# EAGLE design FEP_of_Exodia ver2 (EAGLE 9.6.2)
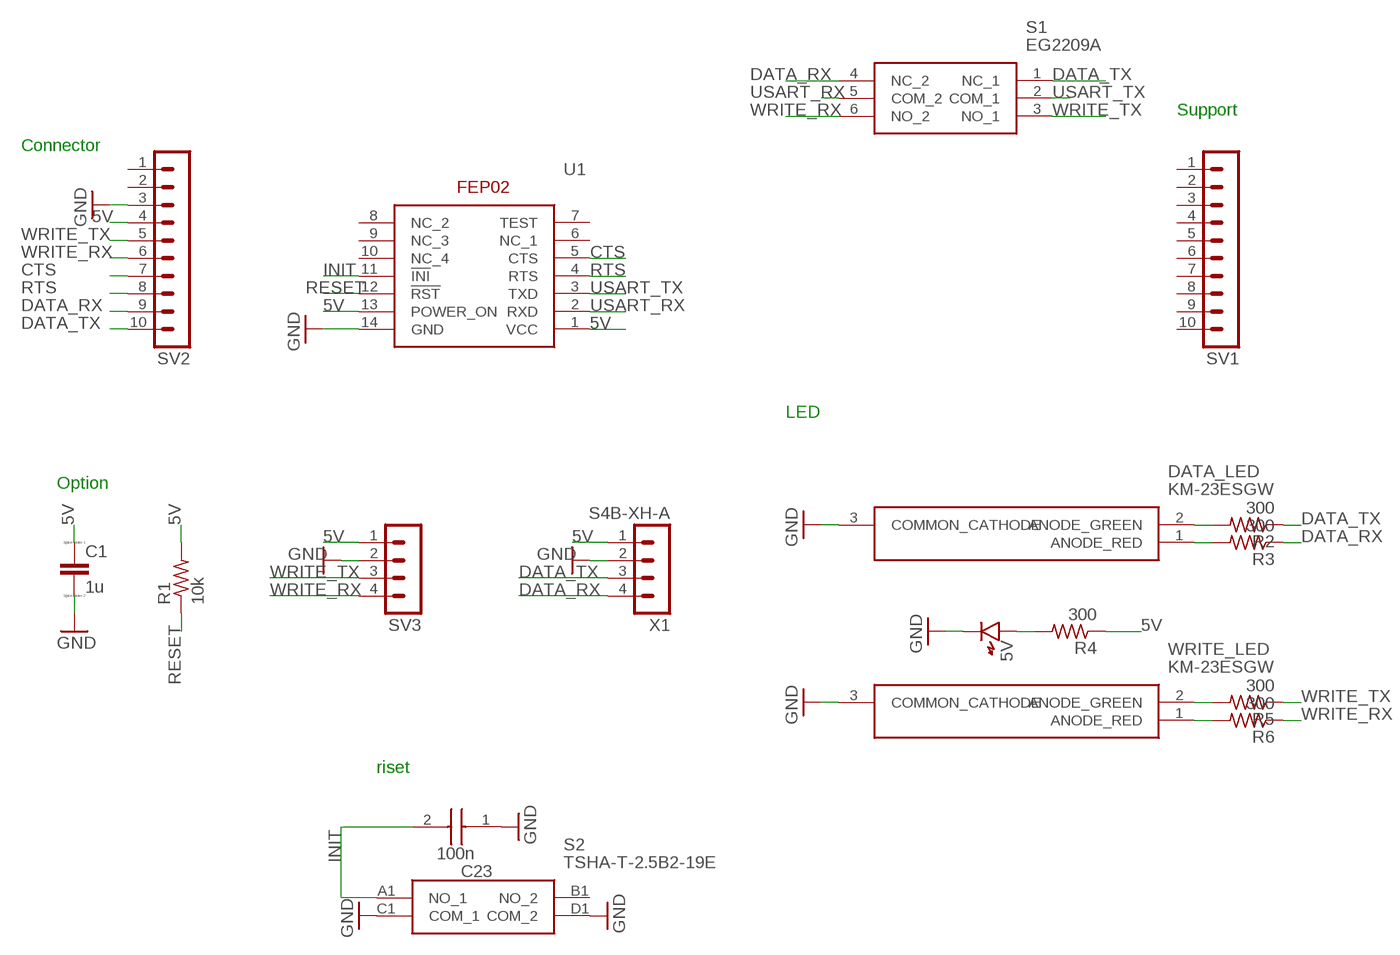
[diagram p0: schematic, sheet 1]

## Parts
5V  LED1608  [LED1608]
C1  1u  CC0603  [C0603]
C23  100n  AMK107BBJ476MA-RE  [CAPC1709X100N]
DATA_LED  KM-23ESGW  [SOT-23]
R1  10k  R-US_R0603  [R0603]
R2  300  R-US_R0603  [R0603]
R3  300  R-US_R0603  [R0603]
R4  300  R-US_R0603  [R0603]
R5  300  R-US_R0603  [R0603]
R6  300  R-US_R0603  [R0603]
S1  EG2209A  [EG2209A]
S2  TSHA-T-2.5B2-19E  [TSHAT25B219E]
SV1  MA10-1  [MA10-1]
SV2  MA10-1  [MA10-1]
SV3  MA04-1  [MA04-1]
U1  FEP02  [FEP02]
WRITE_LED  KM-23ESGW  [SOT-23]
X1  S4B-XH-A  [S4B-XH-A]

## Nets
5V: C1.1 R1.2 R4.1 SV2.4 SV3.1 U1.1(VCC) U1.13(POWER_ON) X1.1
CTS: SV2.7 U1.5(CTS)
DATA_RX: R3.1 S1.4(NC_2) SV2.9 X1.4
DATA_TX: R2.1 S1.1(NC_1) SV2.10 X1.3
GND: 5V.K C1.2 C23.1 DATA_LED.3(COMMON_CATHODE) S2.C1(COM_1) S2.D1(COM_2) SV2.3 SV3.2 U1.14(GND) WRITE_LED.3(COMMON_CATHODE) X1.2
INIT: C23.2 S2.A1(NO_1) U1.11(!INI)
N$1: DATA_LED.1(ANODE_RED) R3.2
N$2: DATA_LED.2(ANODE_GREEN) R2.2
N$3: 5V.A R4.2
N$4: R6.2 WRITE_LED.1(ANODE_RED)
N$5: R5.2 WRITE_LED.2(ANODE_GREEN)
RESET: R1.1 U1.12(!RST)
RTS: SV2.8 U1.4(RTS)
USART_RX: S1.5(COM_2) U1.2(RXD)
USART_TX: S1.2(COM_1) U1.3(TXD)
WRITE_RX: R6.1 S1.6(NO_2) SV2.6 SV3.4
WRITE_TX: R5.1 S1.3(NO_1) SV2.5 SV3.3
Unconnected: S2.B1(NO_2) SV1.1 SV1.2 SV1.3 SV1.4 SV1.5 SV1.6 SV1.7 SV1.8 SV1.9 SV1.10 SV2.1 SV2.2 U1.6(NC_1) U1.7(TEST) U1.8(NC_2) U1.9(NC_3) U1.10(NC_4)

## Notes on the sheet
- Support
- Connector
- LED
- Option
- riset

## Library data of the parts
5V = generic:LED: Generic LEDs
C1 = eagle-ltspice:C: CAPACITOR, European symbol; SPICEMODEL: NONE; SPICEPREFIX: C
C23 = SamacSys_Parts:AMK107BBJ476MA-RE: 0603 (1608M) 47uF MLCC 4V dc +/-20% SMD Source: Datasheet <https://ds.yuden.co.jp/TYCOMPAS/ut/detail?pn=AMK107BBJ476MA-RE&u=M>; DESCRIPTION: 0603 (1608M) 47uF MLCC 4V dc +/-20% SMD; HEIGHT: 1mm; MANUFACTURER_NAME: TAIYO YUDEN; MANUFACTURER_PART_NUMBER: AMK107BBJ476MA-RE; MOUSER_PART_NUMBER: 963-AMK107BBJ476MARE; MOUSER_PRICE-STOCK: https://www.mouser.com/Search/Refine.aspx?Keyword=963-AMK107BBJ476MARE; RS_PART_NUMBER: 1843762P; RS_PRICE-STOCK: http://uk.rs-online.com/web/p/products/1843762P
DATA_LED WRITE_LED = SamacSys_Parts:KM-23ESGW: KINGBRIGHT - KM-23ESGW - LED, SMD, RED/GRN Source: Datasheet <http://www.farnell.com/datasheets/2047454.pdf>; DESCRIPTION: KINGBRIGHT - KM-23ESGW - LED, SMD, RED/GRN; HEIGHT: mm; MANUFACTURER_NAME: Kingbright; MANUFACTURER_PART_NUMBER: KM-23ESGW; MOUSER_PART_NUMBER: N/A; MOUSER_PRICE-STOCK: https://www.mouser.com/Search/Refine.aspx?Keyword=N%2FA
R1-R6 = audio amplifier example:R-US_: RESISTOR, American symbol
S1 = SamacSys_Parts:EG2209A: SLIDE, 100mA 12VDC, DPDT On-On, Through Hole PC Pin Source: Datasheet <https://configured-product-images.s3.amazonaws.com/2D/specs/EG2209A.pdf>; DESCRIPTION: SLIDE, 100mA 12VDC, DPDT On-On, Through Hole PC Pin; HEIGHT: 9.5mm; MANUFACTURER_NAME: E-Switch; MANUFACTURER_PART_NUMBER: EG2209A; MOUSER_PART_NUMBER: 612-EG2209A; MOUSER_PRICE-STOCK: https://www.mouser.co.uk/ProductDetail/E-Switch/EG2209A?qs=HKd%2Fp3M7KlXlU8W13SX7Zg%3D%3D
S2 = SamacSys_Parts:TSHA-T-2.5B2-19E: Switch Source: Datasheet <http://akizukidenshi.com/download/ds/topup/TSHA-T-2.5B2-19E.pdf>; DESCRIPTION: Switch; HEIGHT: 2.5mm; MANUFACTURER_NAME: Akizuki Denshi Tsusho; MANUFACTURER_PART_NUMBER: TSHA-T-2.5B2-19E
SV1 SV2 = con-lstb:MA10-1: PIN HEADER; OC_FARNELL: unknown; OC_NEWARK: unknown
SV3 = con-lstb:MA04-1: PIN HEADER; OC_FARNELL: unknown; OC_NEWARK: unknown
U1 = SamacSys_Parts:FEP02: 920MHz band wireless module [1mW type] FEP-02 Source: Datasheet <https://d21xsz2za2b5mz.cloudfront.net/9616/1948/4745/1M36Q03507_FEP01_02TJ010V7.pdf>; DESCRIPTION: 920MHz band wireless module [1mW type] FEP-02; HEIGHT: 3mm; MANUFACTURER_NAME: Futaba; MANUFACTURER_PART_NUMBER: FEP02
X1 = con-JST_XH:S4B-XH: JST XH series header 2.50mm pitch disconnectable crimp style connectors, horizontal (side entry type), 4 pins

## Board
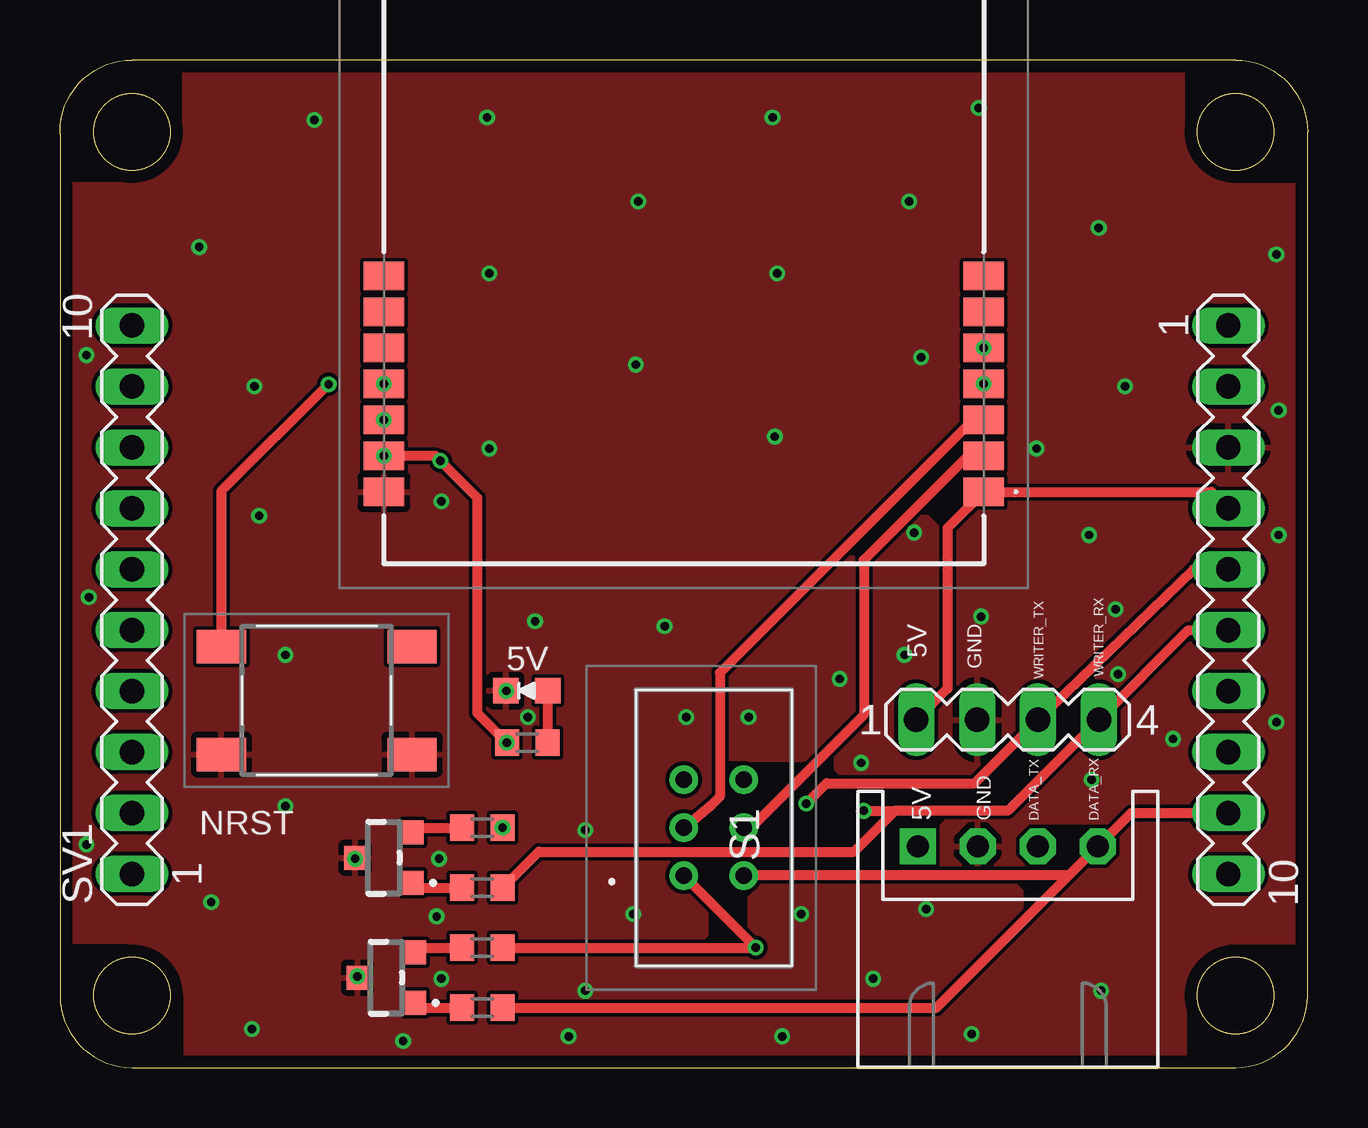
[diagram p1: board, top side]
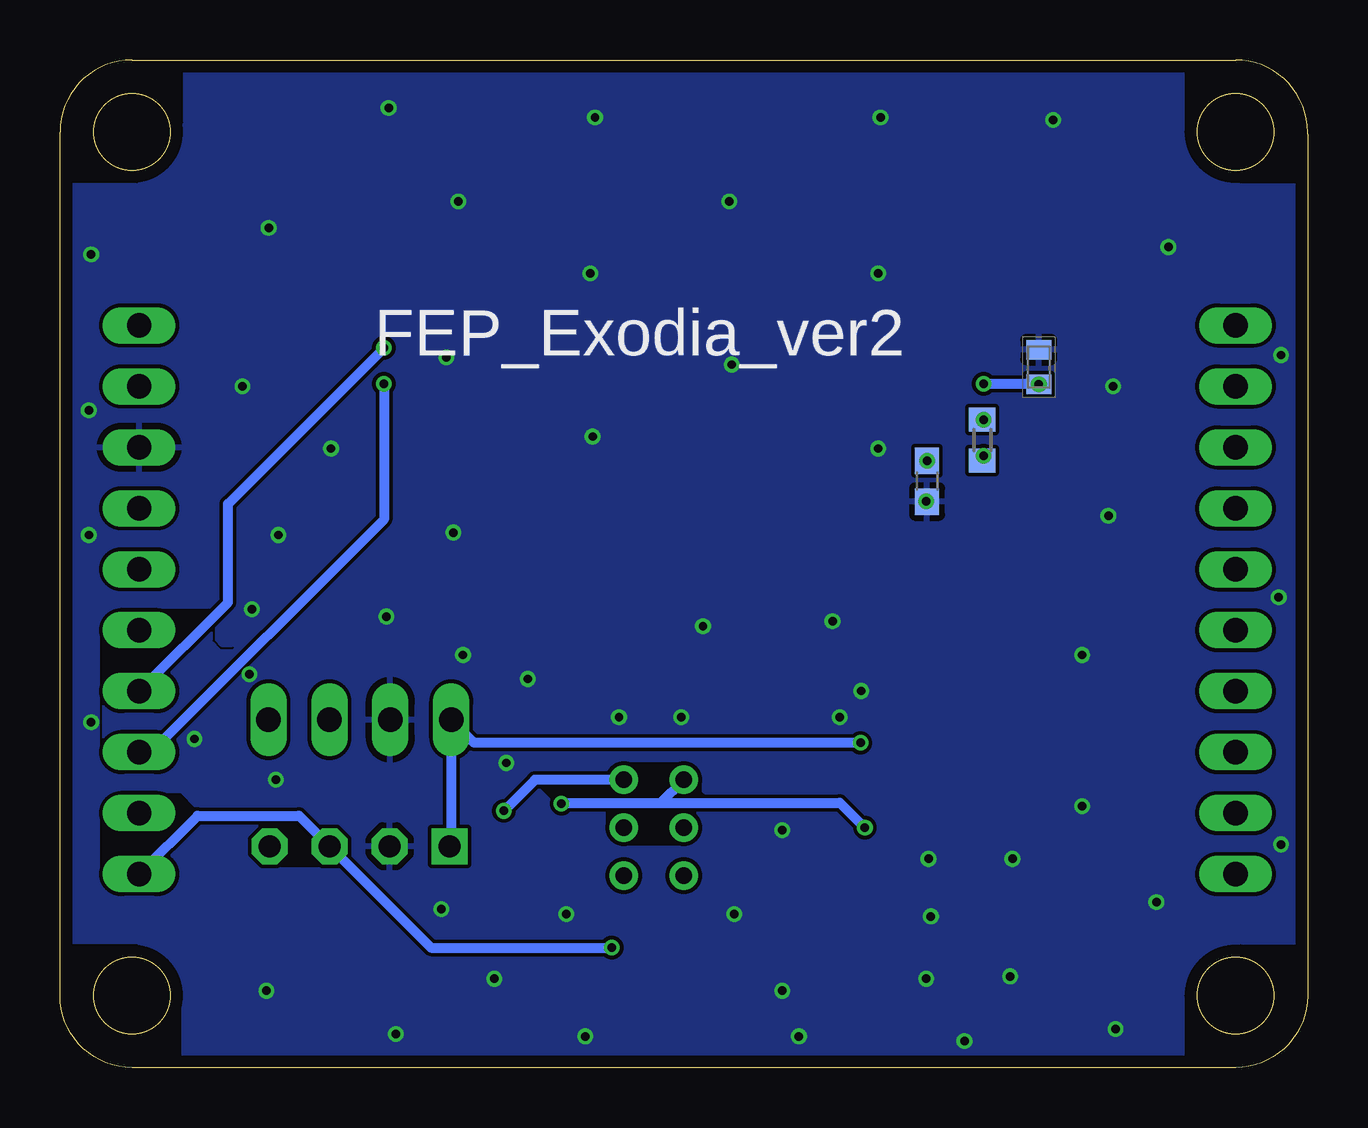
[diagram p2: board, bottom side, seen from below]

Size 52 x 42 mm. Coordinates in mm from the lower left corner, seen from the top.
Outline: 3,0 49,0 arc90 52,3 52,39 arc90 49,42 3,42 arc90 0,39 0,38.9 0,3 arc90 3,0
Outline: circle at 3,3 radius 1.6
Outline: circle at 49,39 radius 1.6
Outline: circle at 3,39 radius 1.6
Outline: circle at 49,3 radius 1.6
Copper layers (1*16): Top 0.035mm / dielectric 1.6mm / Bottom 0.035mm
Design rules "Elecrow_2-layer_PCB_eagle_rule": minimum track width 6mil, minimum drill 12mil, track to track 6mil, track to pad 6mil, pad to pad 6mil, via to via 8mil, smd to smd 0mil, copper to edge 20mil, drill to drill 10mil, minimum pad ring 6mil, minimum via ring 6mil, stop-mask expansion 0mil, vias tented up to drill 100mil, thermal gap 10mil
tRestrict: 27 lines
bRestrict: 23 lines

### Footprints (pad centres in the part's own frame; a part is rotated, then mirrored left to right if it is on the bottom)
LED1608 = smd 1.05 x 1.08: A -0.875,0; K 0.875,0
C0603 = smd 1.1 x 1: 1 -0.85,0; 2 0.85,0
CAPC1709X100N = smd 0.81 x 1.04: 1 -0.72,0; 2 0.72,0
SOT-23 = smd 1 x 0.9: 1 1.05,1.2; 2 -1.05,1.2; 3 0,-1.2
R0603 = smd 1 x 1.1: 1 -0.85,0; 2 0.85,0
EG2209A = drill 0.7 pad 1.2: 1 0,0; 2 2,0; 3 4,0; 4 0,-2.5; 5 2,-2.5; 6 4,-2.5
TSHAT25B219E = smd 2.05 x 1.4: A1 -3.975,2.25; B1 3.975,2.25; C1 -3.975,-2.25; D1 3.975,-2.25
MA10-1 = drill 1.016 long: 1 -11.43,0; 2 -8.89,0; 3 -6.35,0; 4 -3.81,0; 5 -1.27,0; 6 1.27,0; 7 3.81,0; 8 6.35,0; 9 8.89,0; 10 11.43,0
MA04-1 = drill 1.016 long: 1 -3.81,0; 2 -1.27,0; 3 1.27,0; 4 3.81,0
FEP02 = smd 1.7 x 1.2: 1 12.5,-12; 2 12.5,-10.5; 3 12.5,-9; 4 12.5,-7.5; 5 12.5,-6; 6 12.5,-4.5; 7 12.5,-3; 8 -12.5,-3; 9 -12.5,-4.5; 10 -12.5,-6; 11 -12.5,-7.5; 12 -12.5,-9; 13 -12.5,-10.5; 14 -12.5,-12
S4B-XH-A = drill 0.9 pad 1.5 square: 1 3.75,0 | drill 0.9 pad 1.5 octagon: 2 1.25,0; 3 -1.25,0; 4 -3.75,0

### Placement (x,y rotation side)
5V  19.46,15.71 180 top
C1  15.86,24.44 270 bottom
C23  11.2,29.2 270 bottom
DATA_LED  13.6,3.75 270 top
R1  13.56,26.16 270 bottom
R2  17.6,5 180 top
R3  17.6,2.5 180 top
R4  19.48,13.54 0 top
R5  17.6,10 180 top
R6  17.6,7.5 180 top
S1  26,8 90 top
S2  10.7,15.3 0 top
SV1  3,19.5 90 top
SV2  48.7,19.5 270 top
SV3  39.5,14.5 0 top
U1  26,36 0 top
WRITE_LED  13.5,8.75 270 top
X1  39.51,9.22 180 top

### Tracks (layer width: path | path; a pad name or v marks a point on that pad's centre or on a via)
5V  (via drill 0.35)
  Top 0.406: R4.1 17.4,14.77 17.4,23.75 C1.1 15.65,25.5 U1.13 | SV2.4 48.01,24 U1.1 36.99,22.49 36.99,15.8 SV3.1
  Bottom 0.406: X1.1 35.69,9.29 SV3.1 34.73,13.54 R4.1 | R1.2 13.5,25.37 U1.13
  other vias: 18.63,13.54 15.86,25.29 13.5,25.5
CTS  (via drill 0.35)
  Bottom 0.406: SV2.7 45,19.39 45,23.5 U1.5
  other vias: 38.5,30
DATA_RX
  Top 0.406: X1.4 36.54,2.5 R3.1 | X1.4 42.05,8.01 S1.4 | X1.4 44.65,10.61 SV2.9
DATA_TX  (via drill 0.35)
  Top 0.406: R2.1 v29,5 S1.1
  Bottom 0.406: v29,5 36.54,5 X1.3 42.04,10.5 46.27,10.5 SV2.10
GND  (via drill 0.35)
  other vias: 25.2,18.4 26.1,14.6 8,1.6 6.3,6.9 9.4,10.9 9.4,17.2 8.3,23 8.1,28.4 5.8,34.2 10.6,39.5 17.8,39.6 17.9,33.1 17.9,25.8 19.8,18.6 21.9,9.9 23.9,6.4 21.9,3.2 30.1,1.3 30.9,6.4 36.1,6.6 43,12 38.4,18.8 32.5,16.2 42.9,22.2 40.7,25.8 44.4,28.4 43.3,35 38.3,40 29.7,39.6 29.9,33.1 29.8,26.3 43.4,3.2 21.2,1.3 15.8,8.7 15.7,6.3 15.9,3.7 14.3,1.1 50.7,14.4 50.8,22.2 50.7,33.9 50.8,27.4 1.1,29.7 1.2,19.6 1.1,9.3 44,19.1 44.1,16.4 46.4,13.7 12.4,3.8 12.3,8.7 18.6,15.7 35.6,22.3 19.5,14.6 28.7,14.6 33.4,12.7 33.9,3.7 38,1.4 24,29.3 24.1,36.1 35.4,36.1 35.9,29.6 35.2,17.2 15.9,23.6
  pour Top: -4,-3 -4,46.9 58.1,46.9 58.1,-3
  pour Bottom: -2.8,-2 55.3,-2 55.3,44.9 -2.8,44.9
INIT  (via drill 0.35)
  Top 0.406: S2.A1 6.72,24.02 C23.2
  Bottom 0.406: C23.2 13.48,28.48 U1.11
  other vias: 11.2,28.48 13.5,28.5
N$1
  Top 0.406: DATA_LED.1 15,2.5 R3.2
N$2
  Top 0.406: DATA_LED.2 15,5 R2.2
N$3
  Top 0.406: R4.2 5V.A
N$4
  Top 0.406: WRITE_LED.1 14.9,7.5 R6.2
N$5
  Top 0.406: WRITE_LED.2 14.9,10 R5.2
RESET  (via drill 0.35)
  Bottom 0.406: U1.12 R1.1
  other vias: 13.5,27
RTS  (via drill 0.35)
  Bottom 0.406: SV2.8 48.2,13.15 38.5,22.85 U1.4
  other vias: 38.5,28.5
USART_RX
  Top 0.406: S1.5 28.8,10 33.5,14.7 33.5,21.17 37.83,25.5 U1.2
USART_TX
  Top 0.406: S1.2 27.2,11 27.5,11.3 27.5,16.45 38.05,27 U1.3
WRITE_RX  (via drill 0.35)
  Top 0.406: SV2.6 47.04,18.23 SV3.4 39.51,10.7 34.8,10.7 | 34.8,10.7 33.1,9 19.95,9 R6.1 | v33.5,10.7 34.8,10.7
  Bottom 0.406: S1.6 32.2,12 v33.5,10.7
WRITE_TX  (via drill 0.35)
  Top 0.406: SV2.5 47.25,20.77 SV3.3 38.12,11.85 31.95,11.85 v31.1,11
  Bottom 0.406: v31.1,11 31.06,11.04 26.96,11.04 | 26.96,11.04 S1.3 | 26.96,11.04 19.49,11.04 R5.1
  other vias: 18.45,10

### Text on the board
tNames: 5V | GND | WRITER_TX | WRITER_RX | NRST | 5V | GND | DATA_TX | DATA_RX
bNames: FEP_Exodia_ver2